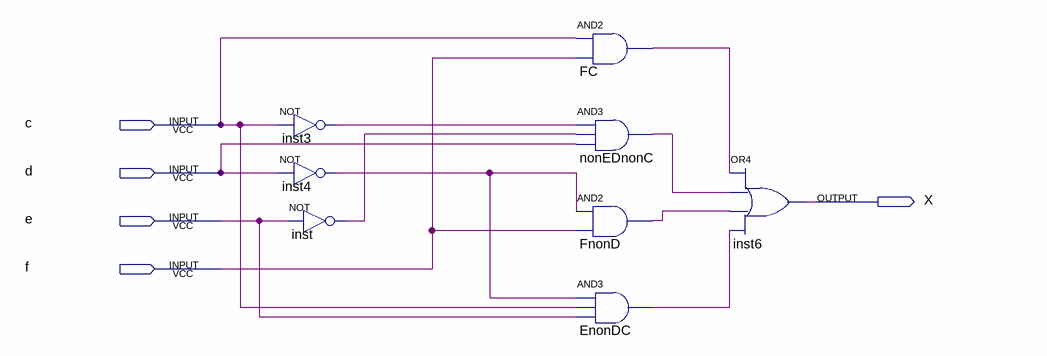
[diagram p0: schematic sheet]
// Quartus schematic JAKUJa0b1.bdf as structural Verilog: 8 symbols, 5 pins
module JAKUJa0b1 (
  input  c,
  input  d,
  input  e,
  input  f,
  output X
);

  wire EnonDC_out, FC_out, FnonD_out, inst3_out, inst4_out, inst_out, nonEDnonC_out;

  not inst3 (inst3_out, c);
  not inst4 (inst4_out, d);
  not inst (inst_out, e);
  and FC (FC_out, c, f);
  and nonEDnonC (nonEDnonC_out, inst3_out, inst_out, d);
  and FnonD (FnonD_out, inst4_out, f);
  and EnonDC (EnonDC_out, inst4_out, c, e);
  or inst6 (X, FC_out, nonEDnonC_out, FnonD_out, EnonDC_out);
endmodule
